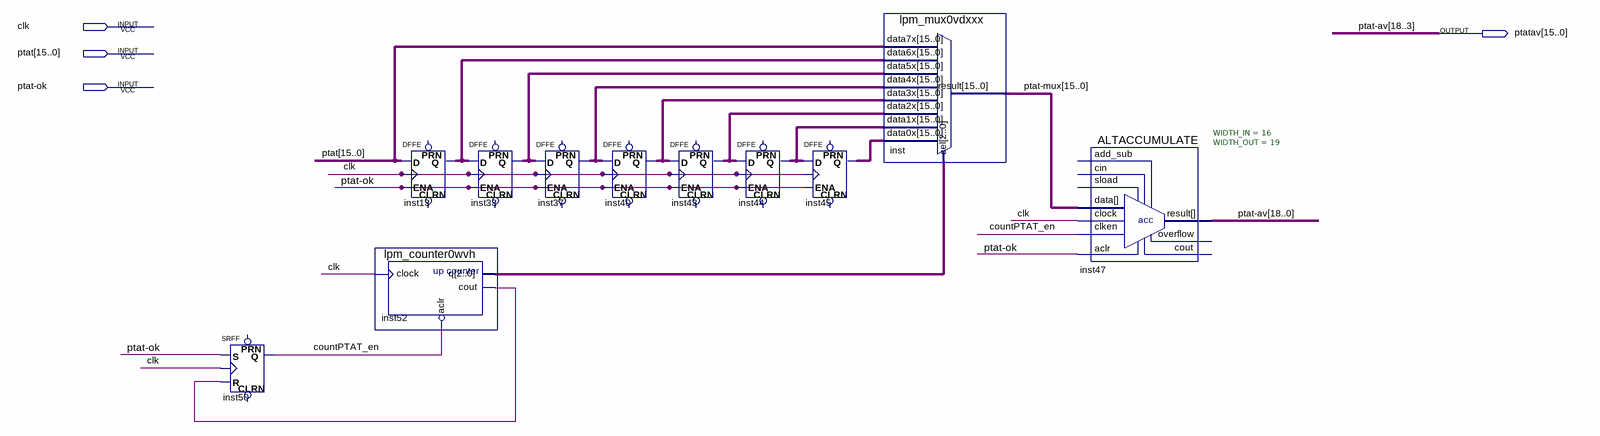
[diagram p0: schematic sheet]
// Quartus schematic Average8.bdf as structural Verilog: 11 symbols, 4 pins
module Average8 (
  input  clk,
  input  [15:0] ptat,
  input  \ptat-ok ,
  output [15:0] ptatav
);

  wire countPTAT_en, inst52_cout;
  wire [2:0] inst52_q, \ptat-av ;
  wire [15:0] inst13_q, inst33_q, inst37_q, inst40_q, inst43_q, inst44_q, inst45_q, \ptat-mux ;

  SRFF inst50 (.S(\ptat-ok ), .R(inst52_cout), .CLK(clk), .Q(countPTAT_en));  // open: PRN, CLRN
  DFFE inst13[15:0] (.D(ptat), .CLK(clk), .ENA(\ptat-ok ), .Q(inst13_q));  // open: PRN, CLRN
  lpm_counter0wvh inst52 (.aclr(~countPTAT_en), .clock(clk), .cout(inst52_cout), .q(inst52_q));
  DFFE inst33[15:0] (.D(inst13_q), .CLK(clk), .ENA(\ptat-ok ), .Q(inst33_q));  // open: PRN, CLRN
  DFFE inst37[15:0] (.D(inst33_q), .CLK(clk), .ENA(\ptat-ok ), .Q(inst37_q));  // open: PRN, CLRN
  DFFE inst40[15:0] (.D(inst37_q), .CLK(clk), .ENA(\ptat-ok ), .Q(inst40_q));  // open: PRN, CLRN
  DFFE inst43[15:0] (.D(inst40_q), .CLK(clk), .ENA(\ptat-ok ), .Q(inst43_q));  // open: PRN, CLRN
  DFFE inst44[15:0] (.D(inst43_q), .CLK(clk), .ENA(\ptat-ok ), .Q(inst44_q));  // open: PRN, CLRN
  DFFE inst45[15:0] (.D(inst44_q), .CLK(clk), .ENA(\ptat-ok ), .Q(inst45_q));  // open: PRN, CLRN
  lpm_mux0vdxxx inst (
    .data7x(ptat), .data6x(inst13_q), .data5x(inst33_q), .data4x(inst37_q), .data3x(inst40_q),
    .data2x(inst43_q), .data1x(inst44_q), .data0x(inst45_q), .sel(inst52_q), .result(\ptat-mux ));
  ALTACCUMULATE #(.WIDTH_IN(16), .WIDTH_OUT(19)) inst47 (
    .aclr(\ptat-ok ), .clock(clk), .clken(countPTAT_en), .data(\ptat-mux ), .result({ptatav, \ptat-av }));  // open: add_sub, cin, sload, cout, overflow

  // Other names for the same wires on the sheet: ptat-av[18:3] = ptatav
endmodule
